# EAGLE schematic ram-2mb (EAGLE 9.5.2)

## Sheet 1 of 3: Interface, Address Decoding
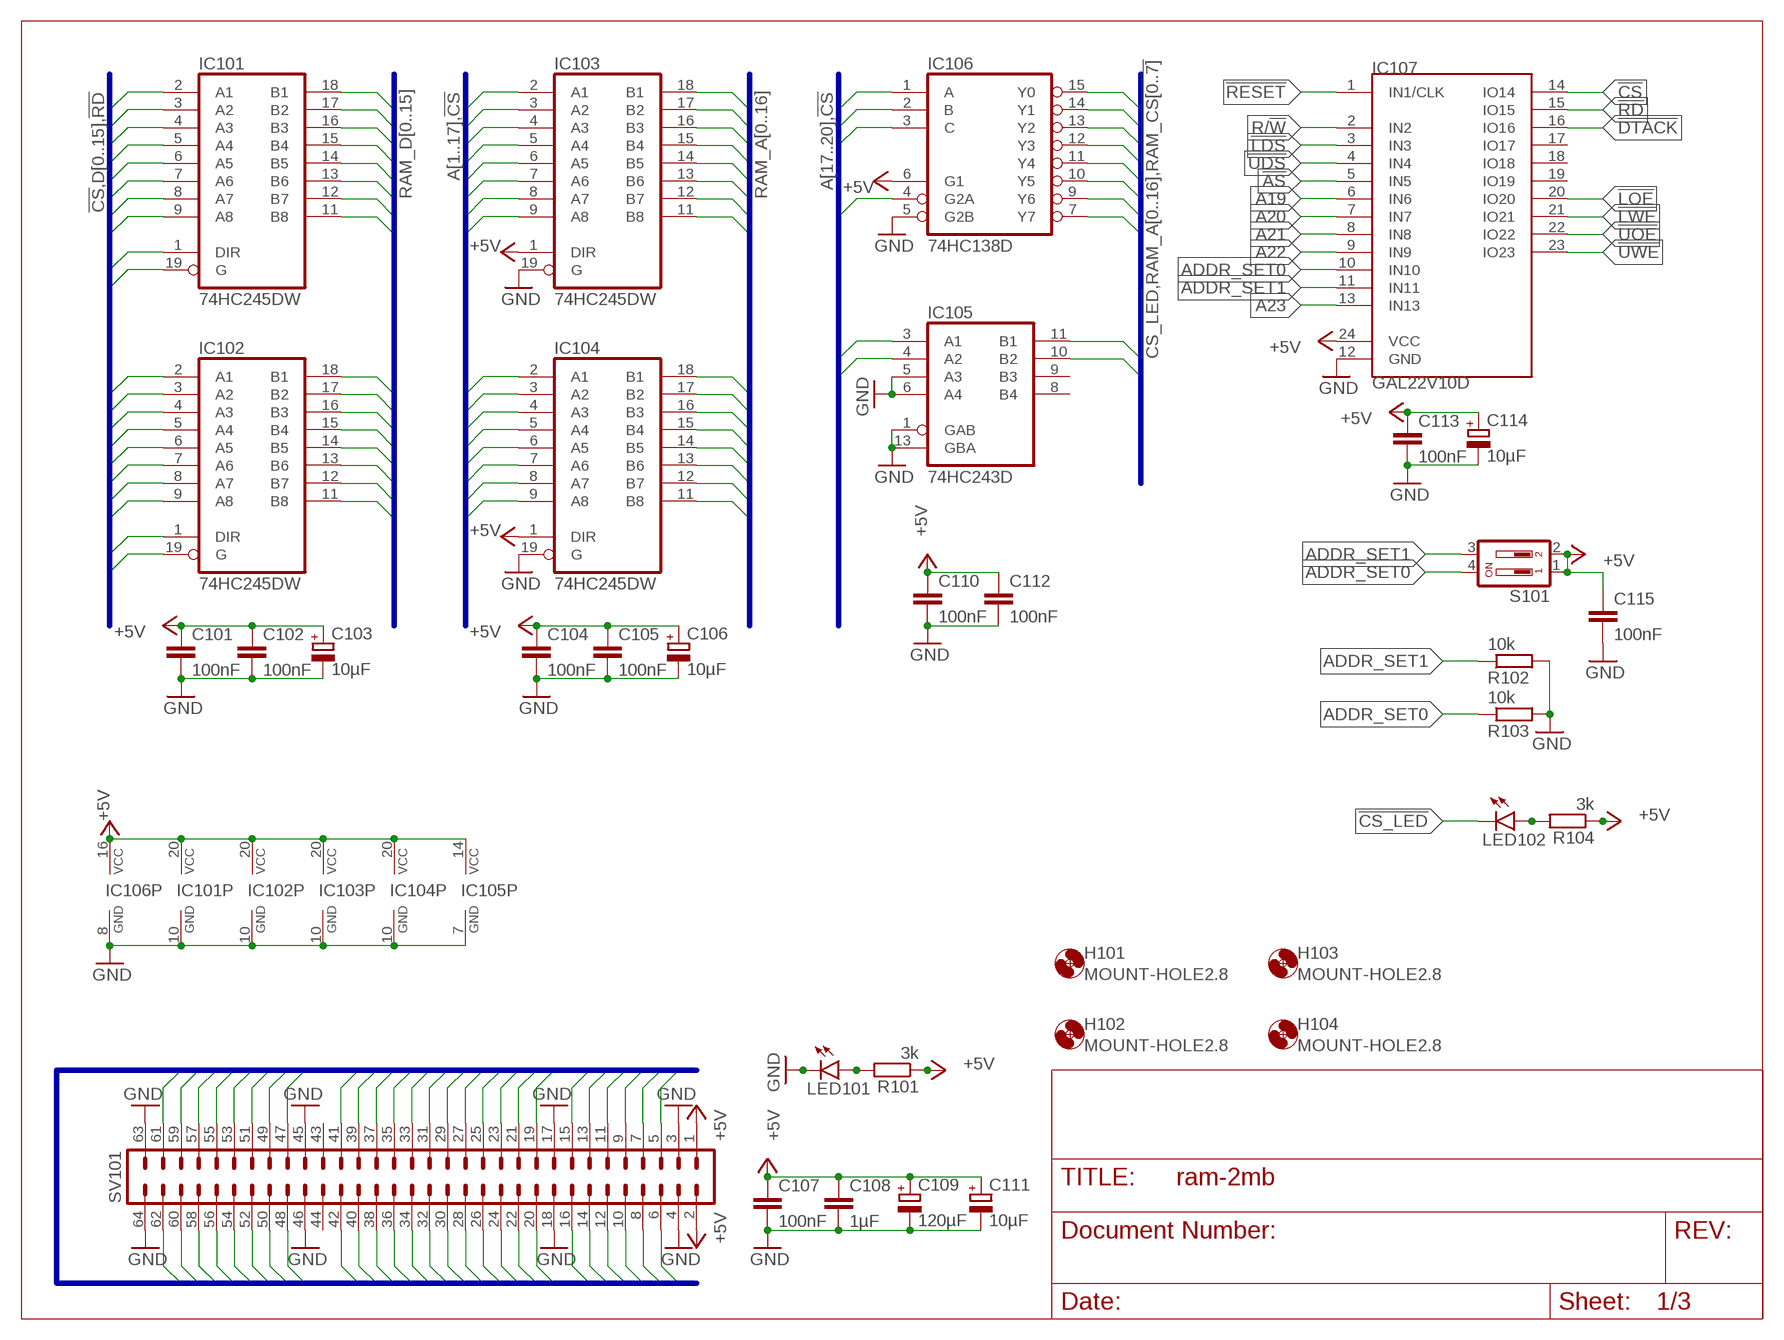
[diagram p0: schematic, sheet 1]

### Parts
C101  100nF  C-EUC0805  [C0805]
C102  100nF  C-EUC0805  [C0805]
C103  10µF  CPOL-EUSMCB  [SMC_B]
C104  100nF  C-EUC0805  [C0805]
C105  100nF  C-EUC0805  [C0805]
C106  10µF  CPOL-EUSMCB  [SMC_B]
C107  100nF  C-EUC0805  [C0805]
C108  1µF  C-EUC0805  [C0805]
C109  120µF  CPOL-EUE2.5-7  [E2,5-7]
C110  100nF  C-EUC0805  [C0805]
C111  10µF  CPOL-EUSMCB  [SMC_B]
C112  100nF  C-EUC0805  [C0805]
C113  100nF  C-EUC0805  [C0805]
C114  10µF  CPOL-EUSMCB  [SMC_B]
C115  100nF  C-EUC0805  [C0805]
H101  MOUNT-HOLE2.8  [2,8]
H102  MOUNT-HOLE2.8  [2,8]
H103  MOUNT-HOLE2.8  [2,8]
H104  MOUNT-HOLE2.8  [2,8]
IC101  74HC245DW  [SO20W]
IC102  74HC245DW  [SO20W]
IC103  74HC245DW  [SO20W]
IC104  74HC245DW  [SO20W]
IC105  74HC243D  [SO14]
IC106  74HC138D  [SO16]
IC107  GAL22V10D  GAL22V10DIP24  [DIL24S]
LED101  LEDCHIPLED_1206  [CHIPLED_1206]
LED102  LEDCHIPLED_1206  [CHIPLED_1206]
R101  3k  R-EU_R2012  [R2012]
R102  10k  R-EU_R2012  [R2012]
R103  10k  R-EU_R2012  [R2012]
R104  3k  R-EU_R2012  [R2012]
S101  DP02  [DP-02]
SV101  ML64L  [ML64L]

### Nets
!AS: IC107.5(IN5) SV101.13
!BG: SV101.9
!BGACK: SV101.8
!BR: SV101.7
!CS: IC101.19(G) IC102.19(G) IC105.4(A2) IC106.4(G2A) IC107.14(IO14)
!CS_LED: IC105.10(B2) LED102.C
!DTACK: IC107.16(IO16) SV101.10
!EXT_ID: SV101.41
!EXTI_A: SV101.16
!EXTI_B: SV101.15
!HALT: SV101.5
!LDS: IC107.3(IN3) SV101.11
!LOE: IC107.20(IO20) ; also sheet 2
!LWE: IC107.21(IO21) ; also sheet 2
!RAM_CS0: IC106.15(Y0) ; also sheet 2,3
!RAM_CS1: IC106.14(Y1) ; also sheet 2,3
!RAM_CS2: IC106.13(Y2) ; also sheet 2,3
!RAM_CS3: IC106.12(Y3) ; also sheet 2,3
!RAM_CS4: IC106.11(Y4) ; also sheet 2,3
!RAM_CS5: IC106.10(Y5) ; also sheet 2,3
!RAM_CS6: IC106.9(Y6) ; also sheet 2,3
!RAM_CS7: IC106.7(Y7) ; also sheet 2,3
!RD: IC101.1(DIR) IC102.1(DIR) IC107.15(IO15)
!RESET: IC107.1(IN1/CLK) SV101.6
!UDS: IC107.4(IN4) SV101.14
!UOE: IC107.22(IO22) ; also sheet 3
!UWE: IC107.23(IO23) ; also sheet 3
+5V: C101.1 C102.1 C103.+ C104.1 C105.1 C106.+ C107.1 C108.1 C109.+ C110.1 C111.+ C112.1 C113.1 C114.+ C115.1 IC101.20(VCC) IC102.20(VCC) IC103.1(DIR) IC103.20(VCC) IC104.1(DIR) IC104.20(VCC) IC105.14(VCC) IC106.6(G1) IC106.16(VCC) IC107.24(VCC) R101.1 R104.1 S101.1 S101.2 SV101.1 SV101.2 ; also sheet 2,3
A1: IC103.2(A1) SV101.20
A2: IC103.3(A2) SV101.22
A3: IC103.4(A3) SV101.19
A4: IC103.5(A4) SV101.24
A5: IC103.6(A5) SV101.21
A6: IC103.7(A6) SV101.23
A7: IC103.8(A7) SV101.26
A8: IC103.9(A8) SV101.25
A9: IC104.2(A1) SV101.28
A10: IC104.3(A2) SV101.27
A11: IC104.4(A3) SV101.30
A12: IC104.5(A4) SV101.29
A13: IC104.6(A5) SV101.31
A14: IC104.7(A6) SV101.32
A15: IC104.8(A7) SV101.33
A16: IC104.9(A8) SV101.34
A17: IC105.3(A1) SV101.36
A18: IC106.1(A) SV101.35
A19: IC106.2(B) IC107.6(IN6) SV101.38
A20: IC106.3(C) IC107.7(IN7) SV101.37
A21: IC107.8(IN8) SV101.40
A22: IC107.9(IN9) SV101.39
A23: IC107.13(IN13) SV101.42
ADDR_SET0: IC107.10(IN10) R103.1 S101.4
ADDR_SET1: IC107.11(IN11) R102.1 S101.3
D0: IC101.2(A1) SV101.62
D1: IC101.3(A2) SV101.60
D2: IC101.4(A3) SV101.58
D3: IC101.5(A4) SV101.56
D4: IC101.6(A5) SV101.54
D5: IC101.7(A6) SV101.52
D6: IC101.8(A7) SV101.50
D7: IC101.9(A8) SV101.48
D8: IC102.2(A1) SV101.57
D9: IC102.3(A2) SV101.59
D10: IC102.4(A3) SV101.61
D11: IC102.5(A4) SV101.55
D12: IC102.6(A5) SV101.53
D13: IC102.7(A6) SV101.51
D14: IC102.8(A7) SV101.49
D15: IC102.9(A8) SV101.47
GND: C101.2 C102.2 C103.- C104.2 C105.2 C106.- C107.2 C108.2 C109.- C110.2 C111.- C112.2 C113.2 C114.- C115.2 IC101.10(GND) IC102.10(GND) IC103.10(GND) IC103.19(G) IC104.10(GND) IC104.19(G) IC105.1(GAB) IC105.5(A3) IC105.6(A4) IC105.7(GND) IC105.13(GBA) IC106.5(G2B) IC106.8(GND) IC107.12(GND) LED101.C R102.2 R103.2 SV101.3 SV101.4 SV101.17 SV101.18 SV101.45 SV101.46 SV101.63 SV101.64 ; also sheet 2,3
N$1: LED102.A R104.2
N$18: LED101.A R101.2
R/!W!: IC107.2(IN2) SV101.12
RAM_A0: IC103.18(B1) ; also sheet 2,3
RAM_A1: IC103.17(B2) ; also sheet 2,3
RAM_A2: IC103.16(B3) ; also sheet 2,3
RAM_A3: IC103.15(B4) ; also sheet 2,3
RAM_A4: IC103.14(B5) ; also sheet 2,3
RAM_A5: IC103.13(B6) ; also sheet 2,3
RAM_A6: IC103.12(B7) ; also sheet 2,3
RAM_A7: IC103.11(B8) ; also sheet 2,3
RAM_A8: IC104.18(B1) ; also sheet 2,3
RAM_A9: IC104.17(B2) ; also sheet 2,3
RAM_A10: IC104.16(B3) ; also sheet 2,3
RAM_A11: IC104.15(B4) ; also sheet 2,3
RAM_A12: IC104.14(B5) ; also sheet 2,3
RAM_A13: IC104.13(B6) ; also sheet 2,3
RAM_A14: IC104.12(B7) ; also sheet 2,3
RAM_A15: IC104.11(B8) ; also sheet 2,3
RAM_A16: IC105.11(B1) ; also sheet 2,3
RAM_D0: IC101.18(B1) ; also sheet 2
RAM_D1: IC101.17(B2) ; also sheet 2
RAM_D2: IC101.16(B3) ; also sheet 2
RAM_D3: IC101.15(B4) ; also sheet 2
RAM_D4: IC101.14(B5) ; also sheet 2
RAM_D5: IC101.13(B6) ; also sheet 2
RAM_D6: IC101.12(B7) ; also sheet 2
RAM_D7: IC101.11(B8) ; also sheet 2
RAM_D8: IC102.18(B1) ; also sheet 3
RAM_D9: IC102.17(B2) ; also sheet 3
RAM_D10: IC102.16(B3) ; also sheet 3
RAM_D11: IC102.15(B4) ; also sheet 3
RAM_D12: IC102.14(B5) ; also sheet 3
RAM_D13: IC102.13(B6) ; also sheet 3
RAM_D14: IC102.12(B7) ; also sheet 3
RAM_D15: IC102.11(B8) ; also sheet 3
Unconnected: IC105.8(B4) IC105.9(B3) IC107.17(IO17) IC107.18(IO18) IC107.19(IO19) SV101.43 SV101.44

### Buses
A[1..23],!AS,!BERR,!BG,!BGACK,!BR,CLK,D[0..15],!DTACK,E,!EXTI_A,!EXTI_B,!EXT_ID,FC[0..2],!HALT,!IPL[0..2],!LDS,!RESET,R/!W!,!UDS,!VMA,!VPA
!CS,D[0..15],!RD
!CS_LED,RAM_A[0..16],!RAM_CS[0..7]
A[17..20],!CS
RAM_D[0..15]
A[1..17],!CS
RAM_A[0..16]

## Sheet 2 of 3: RAM (Low Byte)
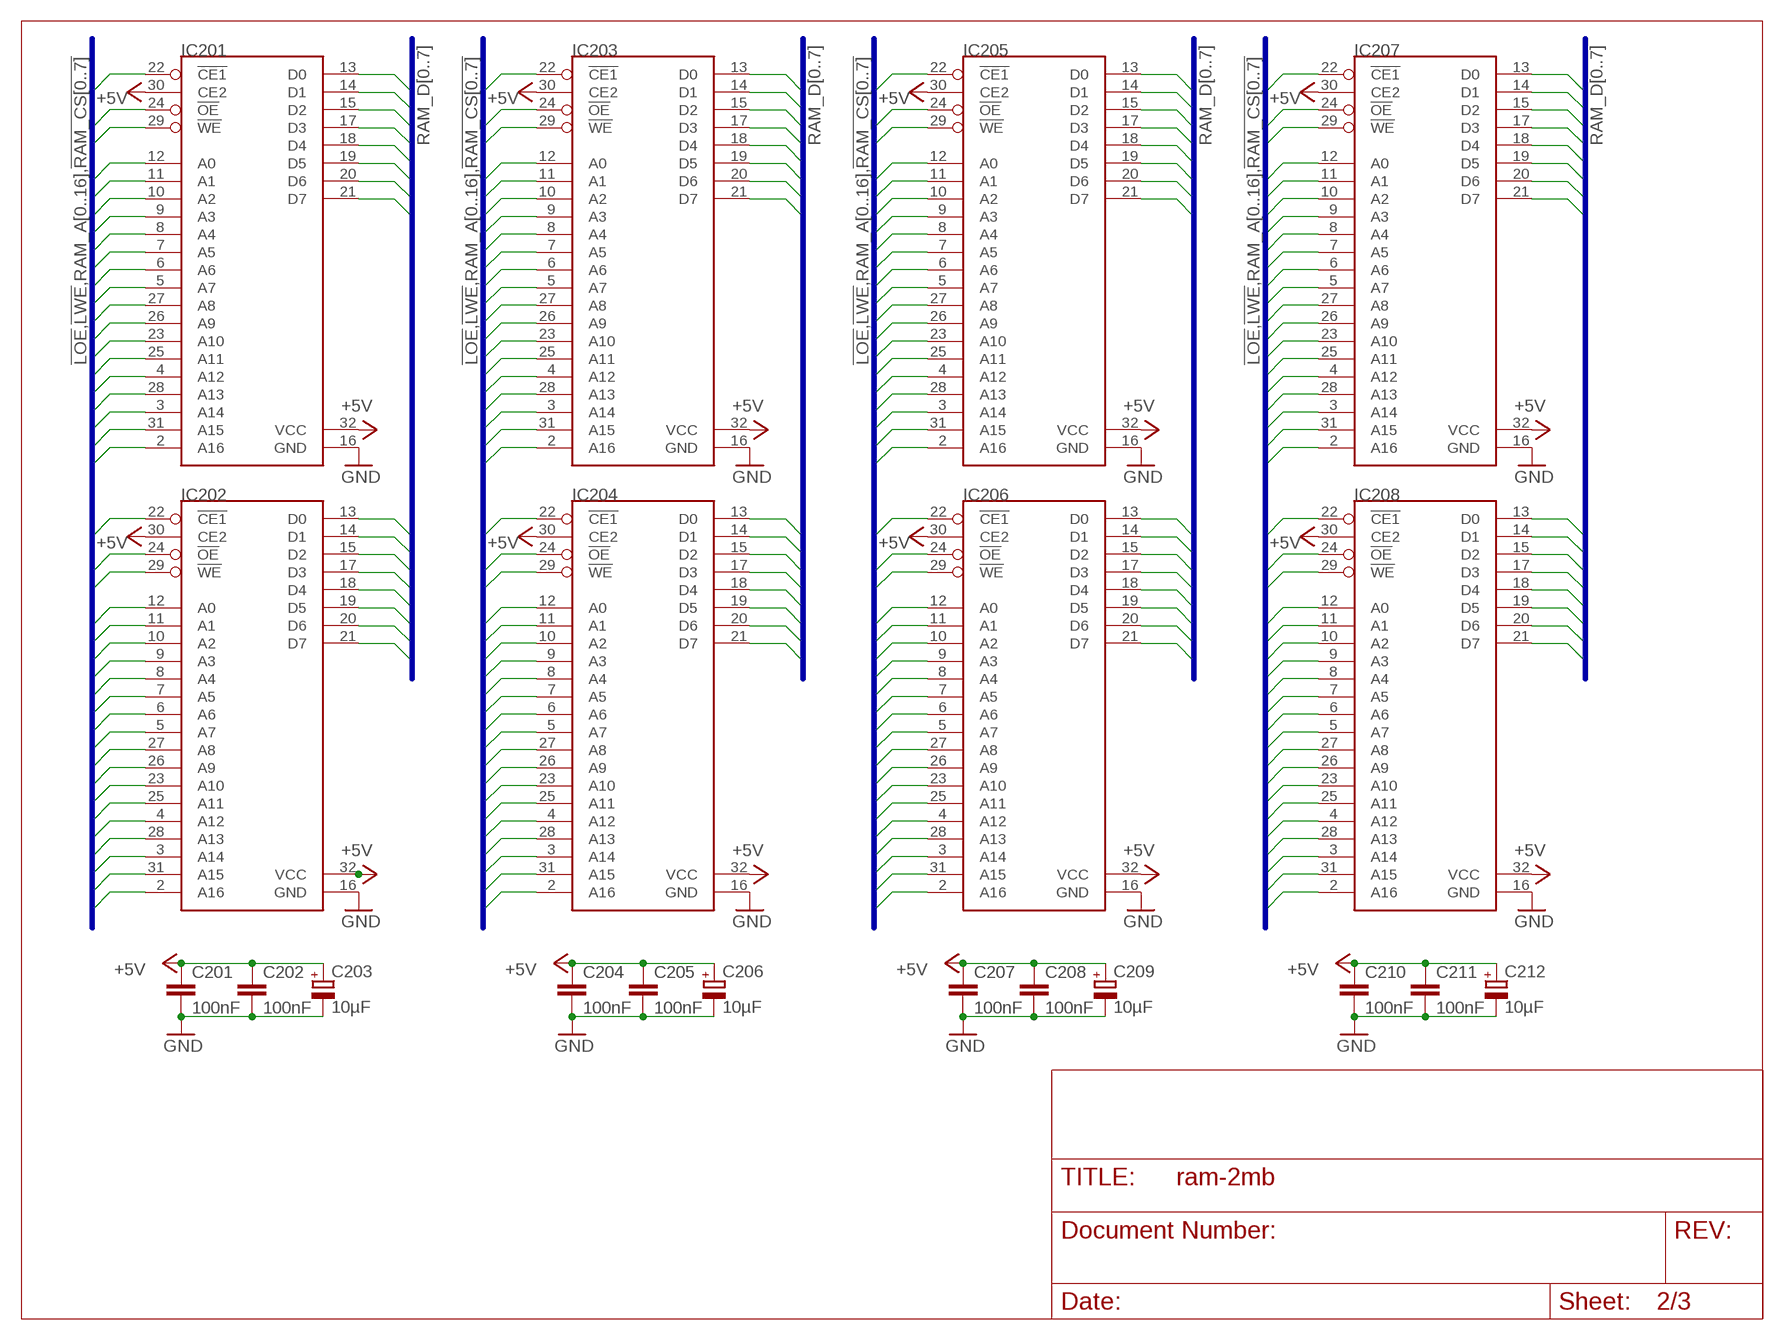
[diagram p1: schematic, sheet 2]

### Parts
C201  100nF  C-EUC0805  [C0805]
C202  100nF  C-EUC0805  [C0805]
C203  10µF  CPOL-EUSMCB  [SMC_B]
C204  100nF  C-EUC0805  [C0805]
C205  100nF  C-EUC0805  [C0805]
C206  10µF  CPOL-EUSMCB  [SMC_B]
C207  100nF  C-EUC0805  [C0805]
C208  100nF  C-EUC0805  [C0805]
C209  10µF  CPOL-EUSMCB  [SMC_B]
C210  100nF  C-EUC0805  [C0805]
C211  100nF  C-EUC0805  [C0805]
C212  10µF  CPOL-EUSMCB  [SMC_B]
IC201  CY62128BSOIC32-450  [SOIC127P1412X299-32N]
IC202  CY62128BSOIC32-450  [SOIC127P1412X299-32N]
IC203  CY62128BSOIC32-450  [SOIC127P1412X299-32N]
IC204  CY62128BSOIC32-450  [SOIC127P1412X299-32N]
IC205  CY62128BSOIC32-450  [SOIC127P1412X299-32N]
IC206  CY62128BSOIC32-450  [SOIC127P1412X299-32N]
IC207  CY62128BSOIC32-450  [SOIC127P1412X299-32N]
IC208  CY62128BSOIC32-450  [SOIC127P1412X299-32N]

### Nets
!LOE: IC201.24(!OE) IC202.24(!OE) IC203.24(!OE) IC204.24(!OE) IC205.24(!OE) IC206.24(!OE) IC207.24(!OE) IC208.24(!OE) ; also sheet 1
!LWE: IC201.29(!WE) IC202.29(!WE) IC203.29(!WE) IC204.29(!WE) IC205.29(!WE) IC206.29(!WE) IC207.29(!WE) IC208.29(!WE) ; also sheet 1
!RAM_CS0: IC201.22(!CE1) ; also sheet 1,3
!RAM_CS1: IC202.22(!CE1) ; also sheet 1,3
!RAM_CS2: IC203.22(!CE1) ; also sheet 1,3
!RAM_CS3: IC204.22(!CE1) ; also sheet 1,3
!RAM_CS4: IC205.22(!CE1) ; also sheet 1,3
!RAM_CS5: IC206.22(!CE1) ; also sheet 1,3
!RAM_CS6: IC207.22(!CE1) ; also sheet 1,3
!RAM_CS7: IC208.22(!CE1) ; also sheet 1,3
+5V: C201.1 C202.1 C203.+ C204.1 C205.1 C206.+ C207.1 C208.1 C209.+ C210.1 C211.1 C212.+ IC201.30(CE2) IC201.32(VCC) IC202.30(CE2) IC202.32(VCC) IC203.30(CE2) IC203.32(VCC) IC204.30(CE2) IC204.32(VCC) IC205.30(CE2) IC205.32(VCC) IC206.30(CE2) IC206.32(VCC) IC207.30(CE2) IC207.32(VCC) IC208.30(CE2) IC208.32(VCC) ; also sheet 1,3
GND: C201.2 C202.2 C203.- C204.2 C205.2 C206.- C207.2 C208.2 C209.- C210.2 C211.2 C212.- IC201.16(GND) IC202.16(GND) IC203.16(GND) IC204.16(GND) IC205.16(GND) IC206.16(GND) IC207.16(GND) IC208.16(GND) ; also sheet 1,3
RAM_A0: IC201.12(A0) IC202.12(A0) IC203.12(A0) IC204.12(A0) IC205.12(A0) IC206.12(A0) IC207.12(A0) IC208.12(A0) ; also sheet 1,3
RAM_A1: IC201.11(A1) IC202.11(A1) IC203.11(A1) IC204.11(A1) IC205.11(A1) IC206.11(A1) IC207.11(A1) IC208.11(A1) ; also sheet 1,3
RAM_A2: IC201.10(A2) IC202.10(A2) IC203.10(A2) IC204.10(A2) IC205.10(A2) IC206.10(A2) IC207.10(A2) IC208.10(A2) ; also sheet 1,3
RAM_A3: IC201.9(A3) IC202.9(A3) IC203.9(A3) IC204.9(A3) IC205.9(A3) IC206.9(A3) IC207.9(A3) IC208.9(A3) ; also sheet 1,3
RAM_A4: IC201.8(A4) IC202.8(A4) IC203.8(A4) IC204.8(A4) IC205.8(A4) IC206.8(A4) IC207.8(A4) IC208.8(A4) ; also sheet 1,3
RAM_A5: IC201.7(A5) IC202.7(A5) IC203.7(A5) IC204.7(A5) IC205.7(A5) IC206.7(A5) IC207.7(A5) IC208.7(A5) ; also sheet 1,3
RAM_A6: IC201.6(A6) IC202.6(A6) IC203.6(A6) IC204.6(A6) IC205.6(A6) IC206.6(A6) IC207.6(A6) IC208.6(A6) ; also sheet 1,3
RAM_A7: IC201.5(A7) IC202.5(A7) IC203.5(A7) IC204.5(A7) IC205.5(A7) IC206.5(A7) IC207.5(A7) IC208.5(A7) ; also sheet 1,3
RAM_A8: IC201.27(A8) IC202.27(A8) IC203.27(A8) IC204.27(A8) IC205.27(A8) IC206.27(A8) IC207.27(A8) IC208.27(A8) ; also sheet 1,3
RAM_A9: IC201.26(A9) IC202.26(A9) IC203.26(A9) IC204.26(A9) IC205.26(A9) IC206.26(A9) IC207.26(A9) IC208.26(A9) ; also sheet 1,3
RAM_A10: IC201.23(A10) IC202.23(A10) IC203.23(A10) IC204.23(A10) IC205.23(A10) IC206.23(A10) IC207.23(A10) IC208.23(A10) ; also sheet 1,3
RAM_A11: IC201.25(A11) IC202.25(A11) IC203.25(A11) IC204.25(A11) IC205.25(A11) IC206.25(A11) IC207.25(A11) IC208.25(A11) ; also sheet 1,3
RAM_A12: IC201.4(A12) IC202.4(A12) IC203.4(A12) IC204.4(A12) IC205.4(A12) IC206.4(A12) IC207.4(A12) IC208.4(A12) ; also sheet 1,3
RAM_A13: IC201.28(A13) IC202.28(A13) IC203.28(A13) IC204.28(A13) IC205.28(A13) IC206.28(A13) IC207.28(A13) IC208.28(A13) ; also sheet 1,3
RAM_A14: IC201.3(A14) IC202.3(A14) IC203.3(A14) IC204.3(A14) IC205.3(A14) IC206.3(A14) IC207.3(A14) IC208.3(A14) ; also sheet 1,3
RAM_A15: IC201.31(A15) IC202.31(A15) IC203.31(A15) IC204.31(A15) IC205.31(A15) IC206.31(A15) IC207.31(A15) IC208.31(A15) ; also sheet 1,3
RAM_A16: IC201.2(A16) IC202.2(A16) IC203.2(A16) IC204.2(A16) IC205.2(A16) IC206.2(A16) IC207.2(A16) IC208.2(A16) ; also sheet 1,3
RAM_D0: IC201.13(D0) IC202.13(D0) IC203.13(D0) IC204.13(D0) IC205.13(D0) IC206.13(D0) IC207.13(D0) IC208.13(D0) ; also sheet 1
RAM_D1: IC201.14(D1) IC202.14(D1) IC203.14(D1) IC204.14(D1) IC205.14(D1) IC206.14(D1) IC207.14(D1) IC208.14(D1) ; also sheet 1
RAM_D2: IC201.15(D2) IC202.15(D2) IC203.15(D2) IC204.15(D2) IC205.15(D2) IC206.15(D2) IC207.15(D2) IC208.15(D2) ; also sheet 1
RAM_D3: IC201.17(D3) IC202.17(D3) IC203.17(D3) IC204.17(D3) IC205.17(D3) IC206.17(D3) IC207.17(D3) IC208.17(D3) ; also sheet 1
RAM_D4: IC201.18(D4) IC202.18(D4) IC203.18(D4) IC204.18(D4) IC205.18(D4) IC206.18(D4) IC207.18(D4) IC208.18(D4) ; also sheet 1
RAM_D5: IC201.19(D5) IC202.19(D5) IC203.19(D5) IC204.19(D5) IC205.19(D5) IC206.19(D5) IC207.19(D5) IC208.19(D5) ; also sheet 1
RAM_D6: IC201.20(D6) IC202.20(D6) IC203.20(D6) IC204.20(D6) IC205.20(D6) IC206.20(D6) IC207.20(D6) IC208.20(D6) ; also sheet 1
RAM_D7: IC201.21(D7) IC202.21(D7) IC203.21(D7) IC204.21(D7) IC205.21(D7) IC206.21(D7) IC207.21(D7) IC208.21(D7) ; also sheet 1

### Buses
!LOE,!LWE,RAM_A[0..16],!RAM_CS[0..7]
RAM_D[0..7]

## Sheet 3 of 3: RAM (High Byte)
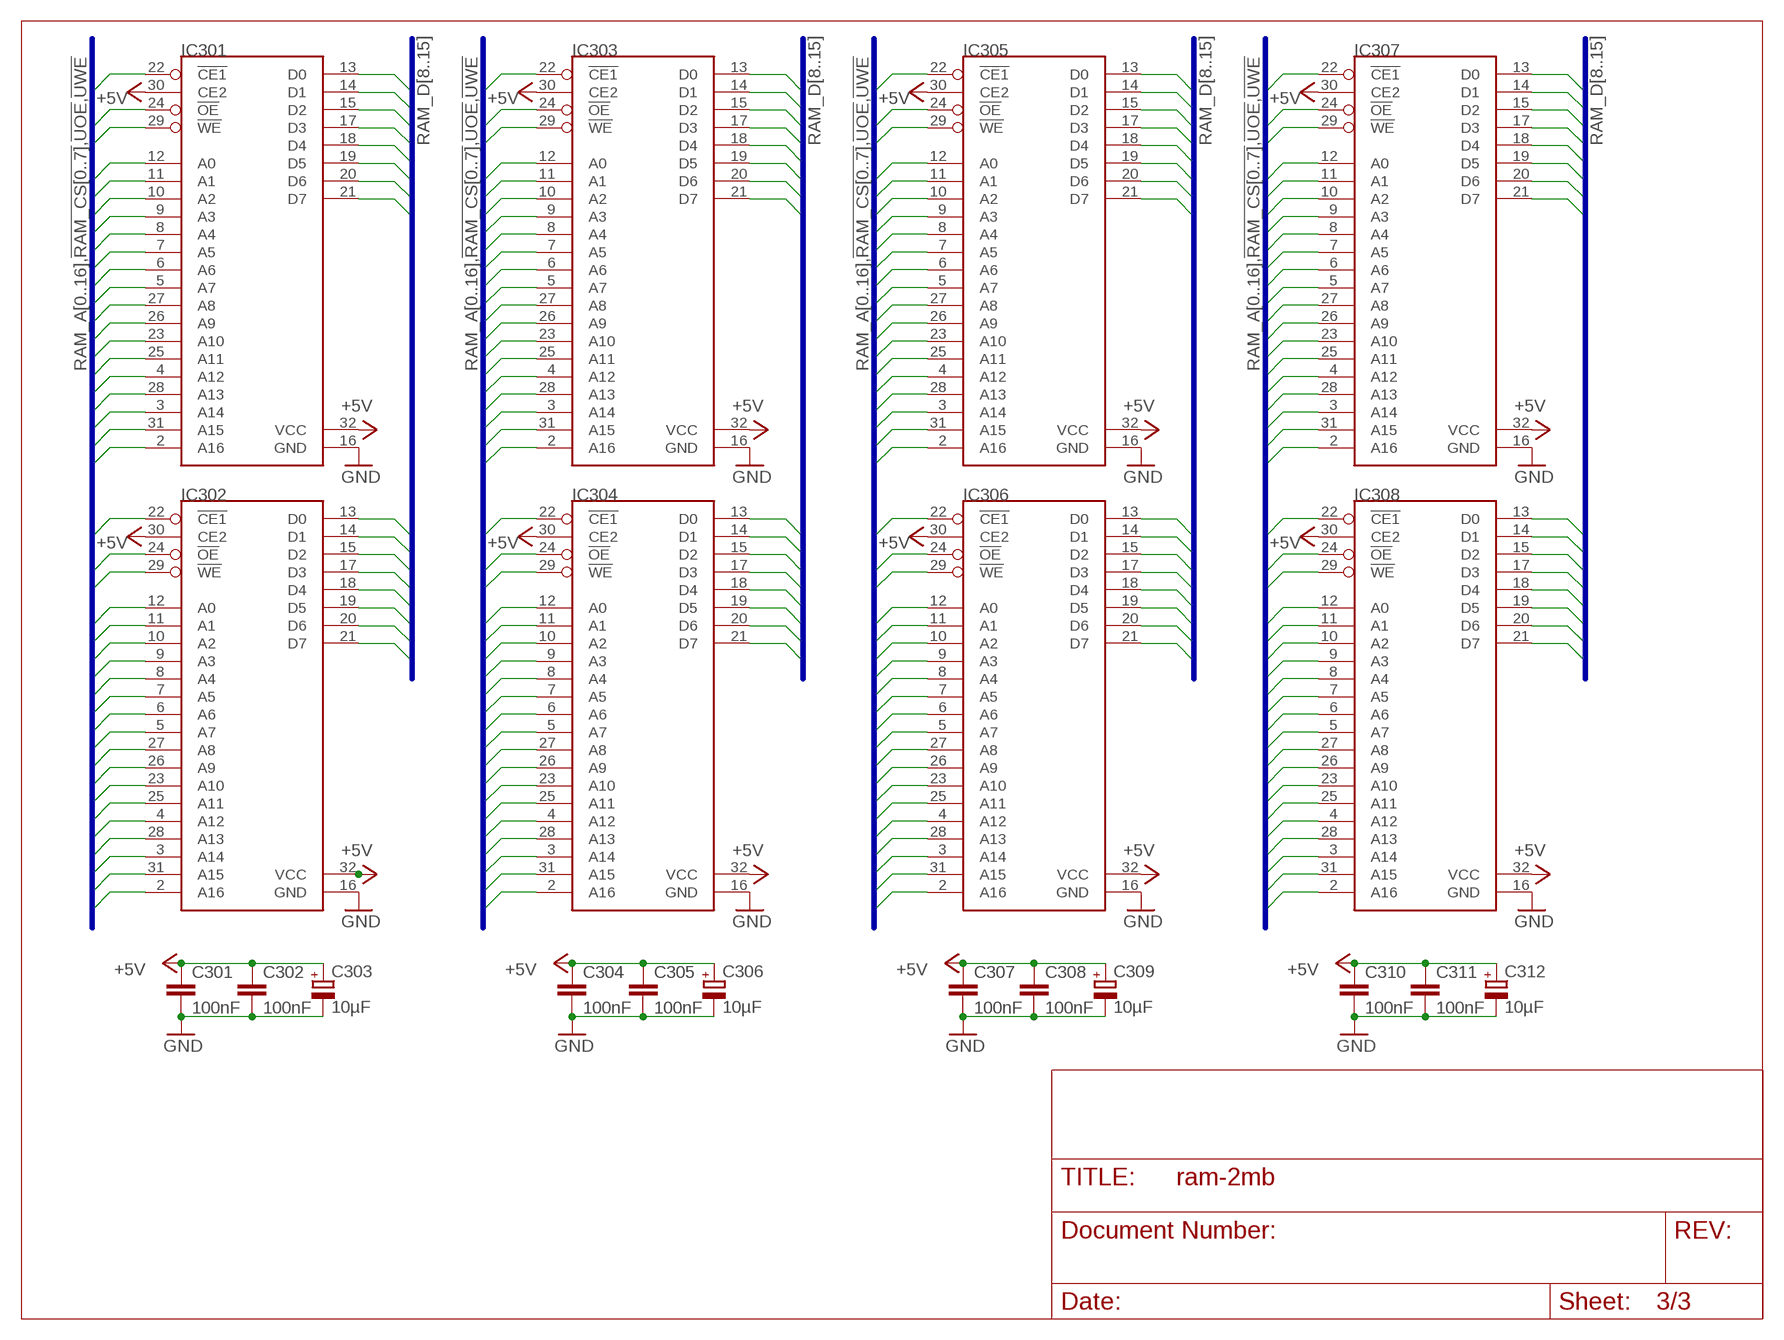
[diagram p2: schematic, sheet 3]

### Parts
C301  100nF  C-EUC0805  [C0805]
C302  100nF  C-EUC0805  [C0805]
C303  10µF  CPOL-EUSMCB  [SMC_B]
C304  100nF  C-EUC0805  [C0805]
C305  100nF  C-EUC0805  [C0805]
C306  10µF  CPOL-EUSMCB  [SMC_B]
C307  100nF  C-EUC0805  [C0805]
C308  100nF  C-EUC0805  [C0805]
C309  10µF  CPOL-EUSMCB  [SMC_B]
C310  100nF  C-EUC0805  [C0805]
C311  100nF  C-EUC0805  [C0805]
C312  10µF  CPOL-EUSMCB  [SMC_B]
IC301  CY62128BSOIC32-450  [SOIC127P1412X299-32N]
IC302  CY62128BSOIC32-450  [SOIC127P1412X299-32N]
IC303  CY62128BSOIC32-450  [SOIC127P1412X299-32N]
IC304  CY62128BSOIC32-450  [SOIC127P1412X299-32N]
IC305  CY62128BSOIC32-450  [SOIC127P1412X299-32N]
IC306  CY62128BSOIC32-450  [SOIC127P1412X299-32N]
IC307  CY62128BSOIC32-450  [SOIC127P1412X299-32N]
IC308  CY62128BSOIC32-450  [SOIC127P1412X299-32N]

### Nets
!RAM_CS0: IC301.22(!CE1) ; also sheet 1,2
!RAM_CS1: IC302.22(!CE1) ; also sheet 1,2
!RAM_CS2: IC303.22(!CE1) ; also sheet 1,2
!RAM_CS3: IC304.22(!CE1) ; also sheet 1,2
!RAM_CS4: IC305.22(!CE1) ; also sheet 1,2
!RAM_CS5: IC306.22(!CE1) ; also sheet 1,2
!RAM_CS6: IC307.22(!CE1) ; also sheet 1,2
!RAM_CS7: IC308.22(!CE1) ; also sheet 1,2
!UOE: IC301.24(!OE) IC302.24(!OE) IC303.24(!OE) IC304.24(!OE) IC305.24(!OE) IC306.24(!OE) IC307.24(!OE) IC308.24(!OE) ; also sheet 1
!UWE: IC301.29(!WE) IC302.29(!WE) IC303.29(!WE) IC304.29(!WE) IC305.29(!WE) IC306.29(!WE) IC307.29(!WE) IC308.29(!WE) ; also sheet 1
+5V: C301.1 C302.1 C303.+ C304.1 C305.1 C306.+ C307.1 C308.1 C309.+ C310.1 C311.1 C312.+ IC301.30(CE2) IC301.32(VCC) IC302.30(CE2) IC302.32(VCC) IC303.30(CE2) IC303.32(VCC) IC304.30(CE2) IC304.32(VCC) IC305.30(CE2) IC305.32(VCC) IC306.30(CE2) IC306.32(VCC) IC307.30(CE2) IC307.32(VCC) IC308.30(CE2) IC308.32(VCC) ; also sheet 1,2
GND: C301.2 C302.2 C303.- C304.2 C305.2 C306.- C307.2 C308.2 C309.- C310.2 C311.2 C312.- IC301.16(GND) IC302.16(GND) IC303.16(GND) IC304.16(GND) IC305.16(GND) IC306.16(GND) IC307.16(GND) IC308.16(GND) ; also sheet 1,2
RAM_A0: IC301.12(A0) IC302.12(A0) IC303.12(A0) IC304.12(A0) IC305.12(A0) IC306.12(A0) IC307.12(A0) IC308.12(A0) ; also sheet 1,2
RAM_A1: IC301.11(A1) IC302.11(A1) IC303.11(A1) IC304.11(A1) IC305.11(A1) IC306.11(A1) IC307.11(A1) IC308.11(A1) ; also sheet 1,2
RAM_A2: IC301.10(A2) IC302.10(A2) IC303.10(A2) IC304.10(A2) IC305.10(A2) IC306.10(A2) IC307.10(A2) IC308.10(A2) ; also sheet 1,2
RAM_A3: IC301.9(A3) IC302.9(A3) IC303.9(A3) IC304.9(A3) IC305.9(A3) IC306.9(A3) IC307.9(A3) IC308.9(A3) ; also sheet 1,2
RAM_A4: IC301.8(A4) IC302.8(A4) IC303.8(A4) IC304.8(A4) IC305.8(A4) IC306.8(A4) IC307.8(A4) IC308.8(A4) ; also sheet 1,2
RAM_A5: IC301.7(A5) IC302.7(A5) IC303.7(A5) IC304.7(A5) IC305.7(A5) IC306.7(A5) IC307.7(A5) IC308.7(A5) ; also sheet 1,2
RAM_A6: IC301.6(A6) IC302.6(A6) IC303.6(A6) IC304.6(A6) IC305.6(A6) IC306.6(A6) IC307.6(A6) IC308.6(A6) ; also sheet 1,2
RAM_A7: IC301.5(A7) IC302.5(A7) IC303.5(A7) IC304.5(A7) IC305.5(A7) IC306.5(A7) IC307.5(A7) IC308.5(A7) ; also sheet 1,2
RAM_A8: IC301.27(A8) IC302.27(A8) IC303.27(A8) IC304.27(A8) IC305.27(A8) IC306.27(A8) IC307.27(A8) IC308.27(A8) ; also sheet 1,2
RAM_A9: IC301.26(A9) IC302.26(A9) IC303.26(A9) IC304.26(A9) IC305.26(A9) IC306.26(A9) IC307.26(A9) IC308.26(A9) ; also sheet 1,2
RAM_A10: IC301.23(A10) IC302.23(A10) IC303.23(A10) IC304.23(A10) IC305.23(A10) IC306.23(A10) IC307.23(A10) IC308.23(A10) ; also sheet 1,2
RAM_A11: IC301.25(A11) IC302.25(A11) IC303.25(A11) IC304.25(A11) IC305.25(A11) IC306.25(A11) IC307.25(A11) IC308.25(A11) ; also sheet 1,2
RAM_A12: IC301.4(A12) IC302.4(A12) IC303.4(A12) IC304.4(A12) IC305.4(A12) IC306.4(A12) IC307.4(A12) IC308.4(A12) ; also sheet 1,2
RAM_A13: IC301.28(A13) IC302.28(A13) IC303.28(A13) IC304.28(A13) IC305.28(A13) IC306.28(A13) IC307.28(A13) IC308.28(A13) ; also sheet 1,2
RAM_A14: IC301.3(A14) IC302.3(A14) IC303.3(A14) IC304.3(A14) IC305.3(A14) IC306.3(A14) IC307.3(A14) IC308.3(A14) ; also sheet 1,2
RAM_A15: IC301.31(A15) IC302.31(A15) IC303.31(A15) IC304.31(A15) IC305.31(A15) IC306.31(A15) IC307.31(A15) IC308.31(A15) ; also sheet 1,2
RAM_A16: IC301.2(A16) IC302.2(A16) IC303.2(A16) IC304.2(A16) IC305.2(A16) IC306.2(A16) IC307.2(A16) IC308.2(A16) ; also sheet 1,2
RAM_D8: IC301.13(D0) IC302.13(D0) IC303.13(D0) IC304.13(D0) IC305.13(D0) IC306.13(D0) IC307.13(D0) IC308.13(D0) ; also sheet 1
RAM_D9: IC301.14(D1) IC302.14(D1) IC303.14(D1) IC304.14(D1) IC305.14(D1) IC306.14(D1) IC307.14(D1) IC308.14(D1) ; also sheet 1
RAM_D10: IC301.15(D2) IC302.15(D2) IC303.15(D2) IC304.15(D2) IC305.15(D2) IC306.15(D2) IC307.15(D2) IC308.15(D2) ; also sheet 1
RAM_D11: IC301.17(D3) IC302.17(D3) IC303.17(D3) IC304.17(D3) IC305.17(D3) IC306.17(D3) IC307.17(D3) IC308.17(D3) ; also sheet 1
RAM_D12: IC301.18(D4) IC302.18(D4) IC303.18(D4) IC304.18(D4) IC305.18(D4) IC306.18(D4) IC307.18(D4) IC308.18(D4) ; also sheet 1
RAM_D13: IC301.19(D5) IC302.19(D5) IC303.19(D5) IC304.19(D5) IC305.19(D5) IC306.19(D5) IC307.19(D5) IC308.19(D5) ; also sheet 1
RAM_D14: IC301.20(D6) IC302.20(D6) IC303.20(D6) IC304.20(D6) IC305.20(D6) IC306.20(D6) IC307.20(D6) IC308.20(D6) ; also sheet 1
RAM_D15: IC301.21(D7) IC302.21(D7) IC303.21(D7) IC304.21(D7) IC305.21(D7) IC306.21(D7) IC307.21(D7) IC308.21(D7) ; also sheet 1

### Buses
RAM_A[0..16],!RAM_CS[0..7],!UOE,!UWE
RAM_D[8..15]

## Library data of the parts
C101 C102 C104 C105 C107 C110 C112 C113 C115 C201 C202 C204 C205 C207 C208 C210 C211 C301 C302 C304 C305 C307 C308 C310 C311 = rcl:C-EU: CAPACITOR, European symbol; MOUSER: 710-885012207072; SPICEPREFIX: C
C103 C106 C111 C114 C203 C206 C209 C212 C303 C306 C309 C312 = rcl:CPOL-EU: POLARIZED CAPACITOR, European symbol; MOUSER: 581-TAJB106K020RNJV; SPICEPREFIX: C
C108 = rcl:C-EU: CAPACITOR, European symbol; MOUSER: 710-885012207078; SPICEPREFIX: C
C109 = rcl:CPOL-EU: POLARIZED CAPACITOR, European symbol; MOUSER: 710-860020373007; SPICEPREFIX: C
H101-H104 = holes:MOUNT-HOLE: MOUNTING HOLE with drill center marker
IC101-IC104 = 74xx-eu:74*245: Octal BUS TRANSCEIVER, 3-state; MOUSER: 595-SN74HC245DWR
IC105 = 74xx-eu:74*243: Quadruple BUS TRANSCEIVER; MOUSER: 595-CD74HC243M96
IC106 = 74xx-eu:74*138: 3-line to 8-line DECODER/DEMULTIPLEXER; MOUSER: 595-SN74HC138DG4
IC107 = 68komputer:GAL22V10: GAL22V10D – Generic Array Logic Datasheet <http://web.mit.edu/6.115/www/document/gal22v10.pdf>; MOUSER_SOCKET: 575-1104732441001000
IC201-IC208 IC301-IC308 = 68komputer:CY62128B: 1-Mbit (128K x 8) Static RAM Datasheet <https://www.westfloridacomponents.com/mm5/graphics/H02/CY62128BLL-55SCT.pdf>
LED101 = led:LED: LED OSRAM: - CHIPLED LG R971, LG N971, LY N971, LG Q971, LY Q971, LO R971, LY R971 LH N974, LH R974 LS Q976, LO Q976, LY Q976 LO Q996 - Hyper CHIPLED LW Q18S LB Q993, LB Q99A, LB R99A - SideLED LS A670, LO A670, LY A670, LG A670, LP A670 LB A673, LV A673, LT A673, LW A673 LH A674 LY A675 LS A676, LA A676, LO A676, LY A676, LW A676 LS A679, LY A679, LG A679 - Hyper Micro SIDELED® LS Y876, LA Y876, LO Y876, LY Y876 LT Y87S - SmartLED LW L88C, LW L88S LB L89C, LB L89S, LG L890 LS L89K, LO L89K, LY L89K LS L896, LA L896, LO L896, LY L896 - TOPLED LS T670, LO T670, LY T670, LG T670, LP T670 LSG T670, LSP T670, LSY T670, LOP T670, LYG T670 LG T671, LOG T671, LSG T671 LB T673, LV T673, LT T673, LW T673 LH T674 LS T676, LA T676, LO T676, LY T676, LB T676, LH T676, LSB T676, LW T676 LB T67C, LV T67C, LT T67C, LS T67K, LO T67K, LY T67K, LW E67C LS E67B, LA E67B, LO E67B, LY E67B, LB E67C, LV E67C, LT E67C LW T67C LS T679, LY T679, LG T679 LS T770, LO T770, LY T770, LG T770, LP T770 LB T773, LV T773, LT T773, LW T773 LH T774 LS E675, LA E675, LY E675, LS T675 LS T776, LA T776, LO T776, LY T776, LB T776 LHGB T686 LT T68C, LB T68C - Hyper Mini TOPLED® LB M676 - Mini TOPLED Santana® LG M470 LS M47K, LO M47K, LY M47K Source: http://www.osram.convergy.de LUXEON: - LUMILED® LXK2-PW12-R00, LXK2-PW12-S00, LXK2-PW14-U00, LXK2-PW14-V00 LXK2-PM12-R00, LXK2-PM12-S00, LXK2-PM14-U00 LXK2-PE12-Q00, LXK2-PE12-R00, LXK2-PE12-S00, LXK2-PE14-T00, LXK2-PE14-U00 LXK2-PB12-K00, LXK2-PB12-L00, LXK2-PB12-M00, LXK2-PB14-N00, LXK2-PB14-P00, LXK2-PB14-Q00 LXK2-PR12-L00, LXK2-PR12-M00, LXK2-PR14-Q00, LXK2-PR14-R00 LXK2-PD12-Q00, LXK2-PD12-R00, LXK2-PD12-S00 LXK2-PH12-R00, LXK2-PH12-S00 LXK2-PL12-P00, LXK2-PL12-Q00, LXK2-PL12-R00 Source: www.luxeon.com KINGBRIGHT: KA-3528ASYC Source: www.kingbright.com; MOUSER: 710-156120YS75300
LED102 = led:LED: LED OSRAM: - CHIPLED LG R971, LG N971, LY N971, LG Q971, LY Q971, LO R971, LY R971 LH N974, LH R974 LS Q976, LO Q976, LY Q976 LO Q996 - Hyper CHIPLED LW Q18S LB Q993, LB Q99A, LB R99A - SideLED LS A670, LO A670, LY A670, LG A670, LP A670 LB A673, LV A673, LT A673, LW A673 LH A674 LY A675 LS A676, LA A676, LO A676, LY A676, LW A676 LS A679, LY A679, LG A679 - Hyper Micro SIDELED® LS Y876, LA Y876, LO Y876, LY Y876 LT Y87S - SmartLED LW L88C, LW L88S LB L89C, LB L89S, LG L890 LS L89K, LO L89K, LY L89K LS L896, LA L896, LO L896, LY L896 - TOPLED LS T670, LO T670, LY T670, LG T670, LP T670 LSG T670, LSP T670, LSY T670, LOP T670, LYG T670 LG T671, LOG T671, LSG T671 LB T673, LV T673, LT T673, LW T673 LH T674 LS T676, LA T676, LO T676, LY T676, LB T676, LH T676, LSB T676, LW T676 LB T67C, LV T67C, LT T67C, LS T67K, LO T67K, LY T67K, LW E67C LS E67B, LA E67B, LO E67B, LY E67B, LB E67C, LV E67C, LT E67C LW T67C LS T679, LY T679, LG T679 LS T770, LO T770, LY T770, LG T770, LP T770 LB T773, LV T773, LT T773, LW T773 LH T774 LS E675, LA E675, LY E675, LS T675 LS T776, LA T776, LO T776, LY T776, LB T776 LHGB T686 LT T68C, LB T68C - Hyper Mini TOPLED® LB M676 - Mini TOPLED Santana® LG M470 LS M47K, LO M47K, LY M47K Source: http://www.osram.convergy.de LUXEON: - LUMILED® LXK2-PW12-R00, LXK2-PW12-S00, LXK2-PW14-U00, LXK2-PW14-V00 LXK2-PM12-R00, LXK2-PM12-S00, LXK2-PM14-U00 LXK2-PE12-Q00, LXK2-PE12-R00, LXK2-PE12-S00, LXK2-PE14-T00, LXK2-PE14-U00 LXK2-PB12-K00, LXK2-PB12-L00, LXK2-PB12-M00, LXK2-PB14-N00, LXK2-PB14-P00, LXK2-PB14-Q00 LXK2-PR12-L00, LXK2-PR12-M00, LXK2-PR14-Q00, LXK2-PR14-R00 LXK2-PD12-Q00, LXK2-PD12-R00, LXK2-PD12-S00 LXK2-PH12-R00, LXK2-PH12-S00 LXK2-PL12-P00, LXK2-PL12-Q00, LXK2-PL12-R00 Source: www.luxeon.com KINGBRIGHT: KA-3528ASYC Source: www.kingbright.com; MOUSER: 710-156120VS75300
R101 R104 = rcl:R-EU_: RESISTOR, European symbol; MOUSER: 652-CR0805JW-302ELF; SPICEPREFIX: R
R102 R103 = rcl:R-EU_: RESISTOR, European symbol; MOUSER: 652-CR0805FX-1002ELF; SPICEPREFIX: R
S101 = switch-dil:DP02: DIL/CODE SWITCH; MPN: MCDP02; OC_FARNELL: 1255233; OC_NEWARK: 26M1095
SV101 = con-harting-ml:ML64: HARTING; OC_FARNELL: unknown; OC_NEWARK: unknown

## Net classes
0 default: width 0.203 mm